# EAGLE design Sensor Board (EAGLE 6.4)

## Sheet 1 of 8: Microcontroller
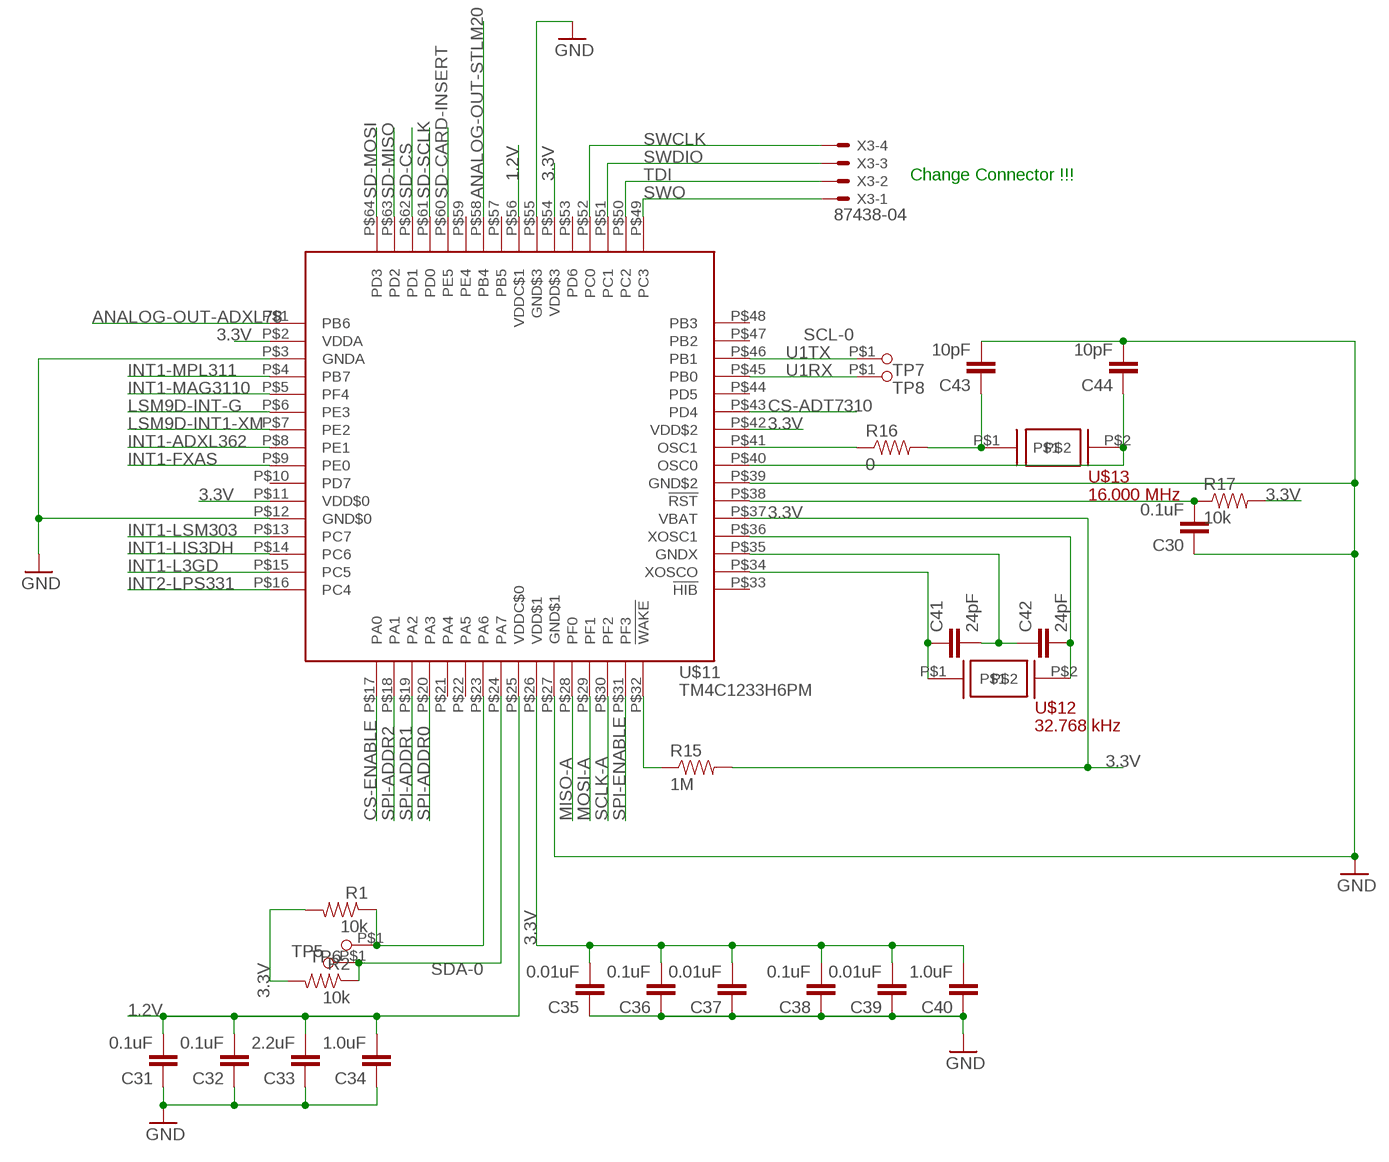
[diagram p0: schematic, sheet 1]

### Parts
C30  0.1uF  CAPACITOR  [0402-CAP]
C31  0.1uF  CAPACITOR  [0402-CAP]
C32  0.1uF  CAPACITOR  [0402-CAP]
C33  2.2uF  CAPACITOR  [0402-CAP]
C34  1.0uF  CAPACITOR  [0402-CAP]
C35  0.01uF  CAPACITOR  [0402-CAP]
C36  0.1uF  CAPACITOR  [0402-CAP]
C37  0.01uF  CAPACITOR  [0402-CAP]
C38  0.1uF  CAPACITOR  [0402-CAP]
C39  0.01uF  CAPACITOR  [0402-CAP]
C40  1.0uF  CAPACITOR  [0402-CAP]
C41  24pF  CAPACITOR  [0402-CAP]
C42  24pF  CAPACITOR  [0402-CAP]
C43  10pF  CAPACITOR  [0402-CAP]
C44  10pF  CAPACITOR  [0402-CAP]
R1  10k  RESISTOR  [0402]
R2  10k  RESISTOR  [0402]
R15  1M  RESISTOR  [0402]
R16  0  RESISTOR  [0402]
R17  10k  RESISTOR  [0402]
TP5  TESTPAD(ROUND)  [TESTPAD(ROUND)]
TP6  TESTPAD(ROUND)  [TESTPAD(ROUND)]
TP7  TESTPAD(ROUND)  [TESTPAD(ROUND)]
TP8  TESTPAD(ROUND)  [TESTPAD(ROUND)]
U$11  TM4C1233H6PM  [S-PQFP-G64]
U$12  32.768 kHz  AB26TRB  [CYLINDRICAL-(1.9DIAX6L)]
U$13  16.000 MHz  NX5032GA  [2-SMD]
X3  87438-04  [87438-04]

### Nets
1.2V: C31.2 C32.2 C33.2 C34.2 U$11.P$25(VDDC$0) U$11.P$56(VDDC$1) ; also sheet 8
3.3V: C35.2 C36.2 C37.2 C38.2 C39.2 C40.2 R1.2 R2.2 R15.2 R17.2 U$11.P$2(VDDA) U$11.P$11(VDD$0) U$11.P$26(VDD$1) U$11.P$37(VBAT) U$11.P$42(VDD$2) U$11.P$54(VDD$3) ; also sheet 2,3,4,5,6,7,8
ANALOG-OUT-ADXL78: U$11.P$1(PB6) ; also sheet 6
ANALOG-OUT-STLM20: U$11.P$58(PB4) ; also sheet 6
CS-ADT7310: U$11.P$43(PD4) ; also sheet 4
CS-ENABLE: U$11.P$17(PA0) ; also sheet 7
GND: C30.1 C31.1 C32.1 C33.1 C34.1 C35.1 C36.1 C37.1 C38.1 C39.1 C40.1 C43.2 C44.2 U$11.P$3(GNDA) U$11.P$12(GND$0) U$11.P$27(GND$1) U$11.P$39(GND$2) U$11.P$55(GND$3) ; also sheet 2,3,4,5,6,7,8
INT1-ADXL362: U$11.P$8(PE1) ; also sheet 4
INT1-FXAS: U$11.P$9(PE0) ; also sheet 5
INT1-L3GD: U$11.P$15(PC5) ; also sheet 3
INT1-LIS3DH: U$11.P$14(PC6) ; also sheet 3
INT1-LSM303: U$11.P$13(PC7) ; also sheet 2
INT1-MAG3110: U$11.P$5(PF4) ; also sheet 5
INT1-MPL311: U$11.P$4(PB7) ; also sheet 5
INT2-LPS331: U$11.P$16(PC4) ; also sheet 3
LSM9D-INT1-XM: U$11.P$7(PE2) ; also sheet 2
LSM9D-INT-G: U$11.P$6(PE3) ; also sheet 2
MISO-A: U$11.P$28(PF0) ; also sheet 7
MOSI-A: U$11.P$29(PF1) ; also sheet 7
N$10: C30.2 R17.1 U$11.P$38(!RST)
N$11: C42.2 U$11.P$36(XOSC1) U$12.P$2
N$12: C41.1 U$11.P$34(XOSCO) U$12.P$1
N$13: C41.2 C42.1 U$11.P$35(GNDX)
N$14: C43.1 R16.2 U$13.P$1
N$16: C44.1 U$11.P$40(OSC0) U$13.P$2
N$17: R16.1 U$11.P$41(OSC1)
N$18: R15.1 U$11.P$32(!WAKE)
SCL-0: R1.1 TP6.P$1 U$11.P$23(PA6) ; also sheet 5
SCLK-A: U$11.P$30(PF2) ; also sheet 7
SD-CARD-INSERT: U$11.P$60(PE5) ; also sheet 7
SD-CS: U$11.P$62(PD1) ; also sheet 7
SD-MISO: U$11.P$63(PD2) ; also sheet 7
SD-MOSI: U$11.P$64(PD3) ; also sheet 7
SD-SCLK: U$11.P$61(PD0) ; also sheet 7
SDA-0: R2.1 TP5.P$1 U$11.P$24(PA7) ; also sheet 5
SPI-ADDR0: U$11.P$20(PA3) ; also sheet 7
SPI-ADDR1: U$11.P$19(PA2) ; also sheet 7
SPI-ADDR2: U$11.P$18(PA1) ; also sheet 7
SPI-ENABLE: U$11.P$31(PF3) ; also sheet 7
SWCLK: U$11.P$52(PC0) X3.4
SWDIO: U$11.P$51(PC1) X3.3
SWO: U$11.P$49(PC3) X3.1
TDI: U$11.P$50(PC2) X3.2
U1RX: TP8.P$1 U$11.P$45(PB0)
U1TX: TP7.P$1 U$11.P$46(PB1)
Unconnected: U$11.P$10(PD7) U$11.P$21(PA4) U$11.P$22(PA5) U$11.P$33(!HIB) U$11.P$44(PD5) U$11.P$47(PB2) U$11.P$48(PB3) U$11.P$53(PD6) U$11.P$57(PB5) U$11.P$59(PE4)

### Notes on the sheet
- Change Connector !!!

## Sheet 2 of 8: STM - Sensors
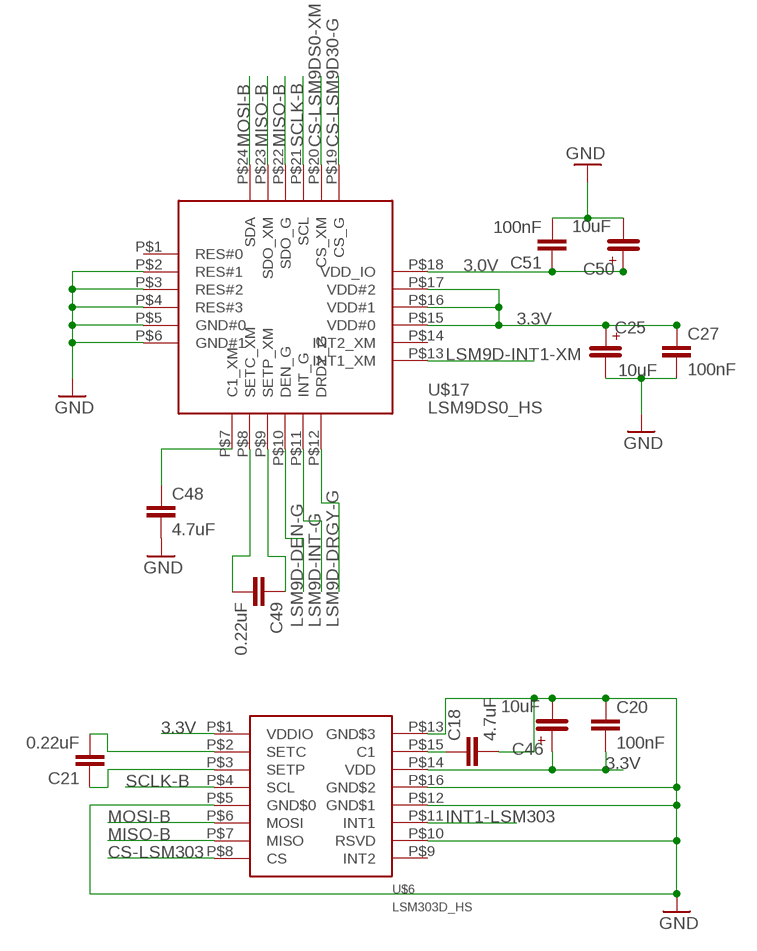
[diagram p1: schematic, sheet 2]

### Parts
C18  4.7uF  CAPACITOR  [0402-CAP]
C20  100nF  CAPACITOR  [0402-CAP]
C21  0.22uF  CAPACITOR  [0402-CAP]
C25  10uF  EEFCD0J100ER  [4.3X7.3SMD]
C27  100nF  CAPACITOR  [0402-CAP]
C46  10uF  EEFCD0J100ER  [4.3X7.3SMD]
C48  4.7uF  CAPACITOR  [0402-CAP]
C49  0.22uF  CAPACITOR  [0402-CAP]
C50  10uF  EEFCD0J100ER  [4.3X7.3SMD]
C51  100nF  CAPACITOR  [0402-CAP]
U$6  LSM303D_HS  [LGA-16(3X3)_HS]
U$17  LSM9DS0_HS  [LGA-24(4X4)_HS]

### Nets
3.0V: C50.P$1 C51.1 U$17.P$18(VDD_IO) ; also sheet 8
3.3V: C20.2 C25.P$1 C27.1 C46.P$1 U$6.P$1(VDDIO) U$6.P$14(VDD) U$17.P$15(VDD#0) U$17.P$16(VDD#1) U$17.P$17(VDD#2) ; also sheet 1,3,4,5,6,7,8
CS-LSM9D30-G: U$17.P$19(CS_G) ; also sheet 7
CS-LSM9DS0-XM: U$17.P$20(CS_XM) ; also sheet 7
CS-LSM303: U$6.P$8(CS) ; also sheet 7
GND: C18.2 C20.1 C25.P$2 C27.2 C46.P$2 C48.2 C50.P$2 C51.2 U$6.P$5(GND$0) U$6.P$10(RSVD) U$6.P$12(GND$1) U$6.P$13(GND$3) U$6.P$16(GND$2) U$17.P$2(RES#1) U$17.P$3(RES#2) U$17.P$4(RES#3) U$17.P$5(GND#0) U$17.P$6(GND#1) ; also sheet 1,3,4,5,6,7,8
INT1-LSM303: U$6.P$11(INT1) ; also sheet 1
LSM9D-DEN-G: U$17.P$10(DEN_G)
LSM9D-DRGY-G: U$17.P$12(DRDY_G)
LSM9D-INT1-XM: U$17.P$13(INT1_XM) ; also sheet 1
LSM9D-INT-G: U$17.P$11(INT_G) ; also sheet 1
MISO-B: U$6.P$7(MISO) U$17.P$22(SDO_G) U$17.P$23(SDO_XM) ; also sheet 3,4,5,7
MOSI-B: U$6.P$6(MOSI) U$17.P$24(SDA) ; also sheet 3,4,5,7
N$6: C18.1 U$6.P$15(C1)
N$7: C21.2 U$6.P$2(SETC)
N$8: C48.1 U$17.P$7(C1_XM)
N$15: C21.1 U$6.P$3(SETP)
N$21: C49.2 U$17.P$8(SETC_XM)
N$22: C49.1 U$17.P$9(SETP_XM)
SCLK-B: U$6.P$4(SCL) U$17.P$21(SCL) ; also sheet 3,4,5,7
Unconnected: U$6.P$9(INT2) U$17.P$1(RES#0) U$17.P$14(INT2_XM)

## Sheet 3 of 8: STM - Sensors 2
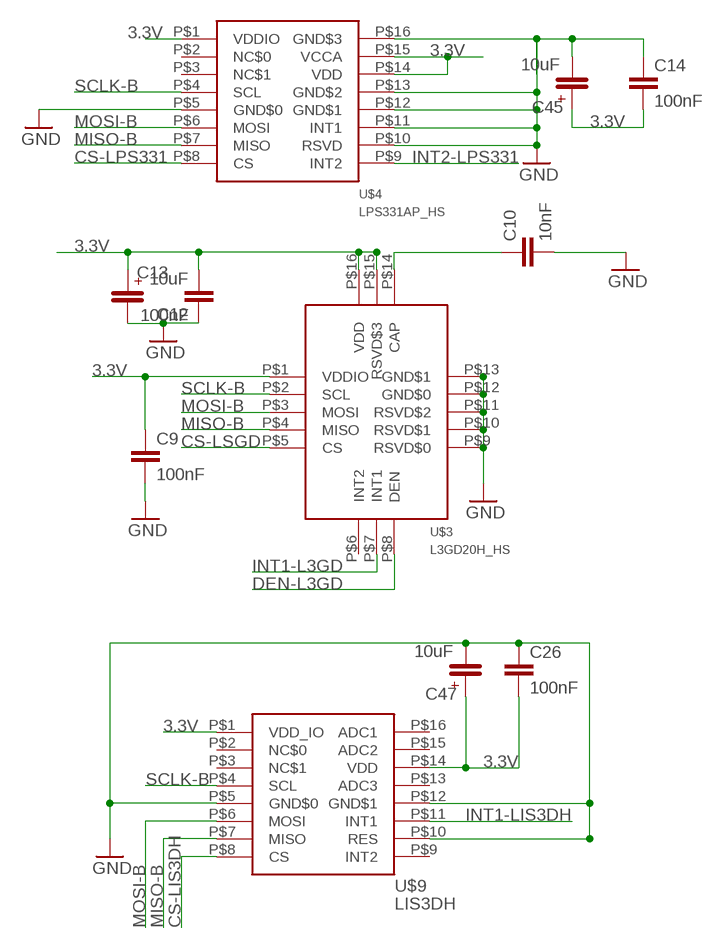
[diagram p2: schematic, sheet 3]

### Parts
C9  100nF  CAPACITOR  [0402-CAP]
C10  10nF  CAPACITOR  [0402-CAP]
C12  10uF  CAPACITOR  [0402-CAP]
C13  100nF  EEFCD0J100ER  [4.3X7.3SMD]
C14  100nF  CAPACITOR  [0402-CAP]
C26  100nF  CAPACITOR  [0402-CAP]
C45  10uF  EEFCD0J100ER  [4.3X7.3SMD]
C47  10uF  EEFCD0J100ER  [4.3X7.3SMD]
U$3  L3GD20H_HS  [LGA-16(3X3)_HS]
U$4  LPS331AP_HS  [LGA-16(3X3)_HS]
U$9  LIS3DH  LIS3DH_HS  [LGA-16(3X3)_HS]

### Nets
3.3V: C9.1 C12.2 C13.P$1 C14.2 C26.2 C45.P$1 C47.P$1 U$3.P$1(VDDIO) U$3.P$15(RSVD$3) U$3.P$16(VDD) U$4.P$1(VDDIO) U$4.P$14(VDD) U$4.P$15(VCCA) U$9.P$1(VDD_IO) U$9.P$14(VDD) ; also sheet 1,2,4,5,6,7,8
CS-LIS3DH: U$9.P$8(CS) ; also sheet 7
CS-LPS331: U$4.P$8(CS) ; also sheet 7
CS-LSGD: U$3.P$5(CS) ; also sheet 7
DEN-L3GD: U$3.P$8(DEN)
GND: C9.2 C10.2 C12.1 C13.P$2 C14.1 C26.1 C45.P$2 C47.P$2 U$3.P$9(RSVD$0) U$3.P$10(RSVD$1) U$3.P$11(RSVD$2) U$3.P$12(GND$0) U$3.P$13(GND$1) U$4.P$5(GND$0) U$4.P$10(RSVD) U$4.P$11(INT1) U$4.P$12(GND$1) U$4.P$13(GND$2) U$4.P$16(GND$3) U$9.P$5(GND$0) U$9.P$10(RES) U$9.P$12(GND$1) ; also sheet 1,2,4,5,6,7,8
INT1-L3GD: U$3.P$7(INT1) ; also sheet 1
INT1-LIS3DH: U$9.P$11(INT1) ; also sheet 1
INT2-LPS331: U$4.P$9(INT2) ; also sheet 1
MISO-B: U$3.P$4(MISO) U$4.P$7(MISO) U$9.P$7(MISO) ; also sheet 2,4,5,7
MOSI-B: U$3.P$3(MOSI) U$4.P$6(MOSI) U$9.P$6(MOSI) ; also sheet 2,4,5,7
N$4: C10.1 U$3.P$14(CAP)
SCLK-B: U$3.P$2(SCL) U$4.P$4(SCL) U$9.P$4(SCL) ; also sheet 2,4,5,7
Unconnected: U$3.P$6(INT2) U$4.P$2(NC$0) U$4.P$3(NC$1) U$9.P$2(NC$0) U$9.P$3(NC$1) U$9.P$9(INT2) U$9.P$13(ADC3) U$9.P$15(ADC2) U$9.P$16(ADC1)

## Sheet 4 of 8: ADXL - Sensors
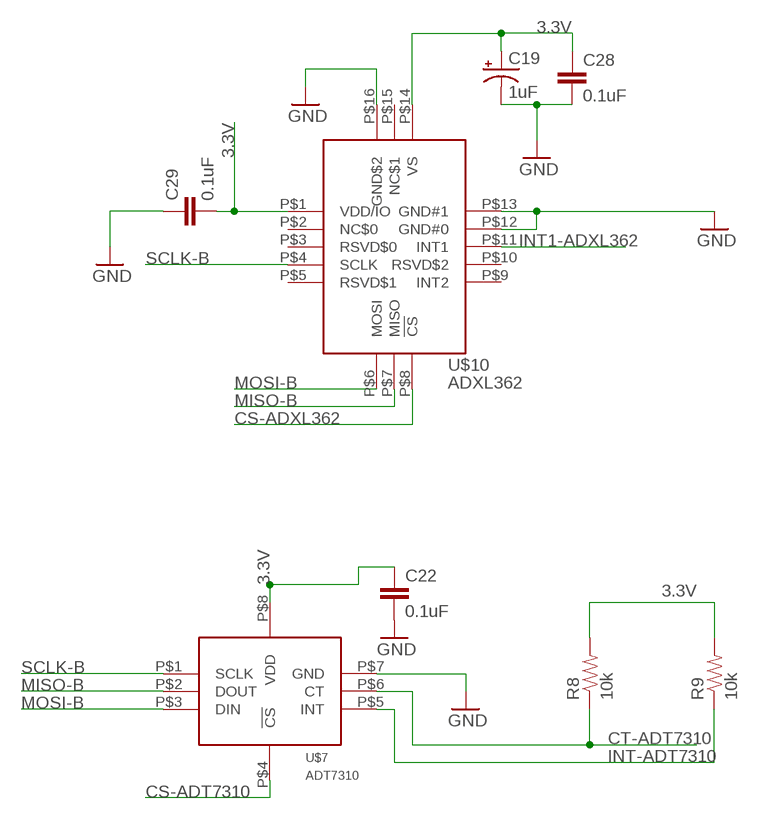
[diagram p3: schematic, sheet 4]

### Parts
C19  1uF  CAP_POL6032  [EIA6032]
C22  0.1uF  CAPACITOR  [0402-CAP]
C28  0.1uF  CAPACITOR  [0402-CAP]
C29  0.1uF  CAPACITOR  [0402-CAP]
R8  10k  RESISTOR  [0402]
R9  10k  RESISTOR  [0402]
U$7  ADT7310  [SOIC-8(5X6.2)]
U$10  ADXL362  ADXL362_HS  [LGA-16(3X3.25)_HS]

### Nets
3.3V: C19.P$1(+) C22.1 C28.1 C29.2 R8.2 R9.2 U$7.P$8(VDD) U$10.P$1(VDD/IO) U$10.P$14(VS) ; also sheet 1,2,3,5,6,7,8
CS-ADT7310: U$7.P$4(!CS) ; also sheet 1
CS-ADXL362: U$10.P$8(!CS) ; also sheet 7
CT-ADT7310: R8.1 U$7.P$6(CT)
GND: C19.P$2(-) C22.2 C28.2 C29.1 U$7.P$7(GND) U$10.P$12(GND#0) U$10.P$13(GND#1) U$10.P$16(GND$2) ; also sheet 1,2,3,5,6,7,8
INT1-ADXL362: U$10.P$11(INT1) ; also sheet 1
INT-ADT7310: R9.1 U$7.P$5(INT)
MISO-B: U$7.P$2(DOUT) U$10.P$7(MISO) ; also sheet 2,3,5,7
MOSI-B: U$7.P$3(DIN) U$10.P$6(MOSI) ; also sheet 2,3,5,7
SCLK-B: U$7.P$1(SCLK) U$10.P$4(SCLK) ; also sheet 2,3,5,7
Unconnected: U$10.P$2(NC$0) U$10.P$3(RSVD$0) U$10.P$5(RSVD$1) U$10.P$9(INT2) U$10.P$10(RSVD$2) U$10.P$15(NC$1)

## Sheet 5 of 8: Freescale - Sensors
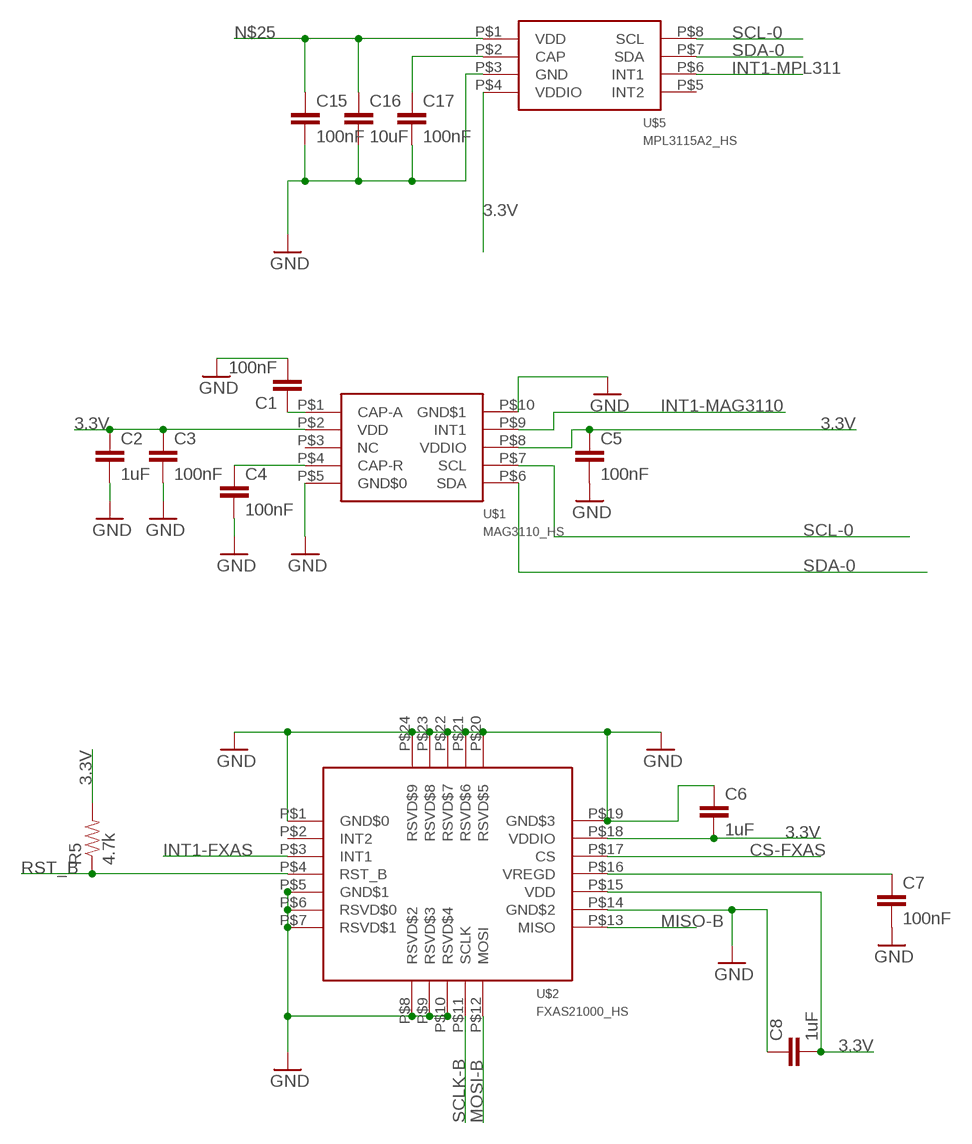
[diagram p4: schematic, sheet 5]

### Parts
C1  100nF  CAPACITOR  [0402-CAP]
C2  1uF  CAPACITOR  [0402-CAP]
C3  100nF  CAPACITOR  [0402-CAP]
C4  100nF  CAPACITOR  [0402-CAP]
C5  100nF  CAPACITOR  [0402-CAP]
C6  1uF  CAPACITOR  [0402-CAP]
C7  100nF  CAPACITOR  [0402-CAP]
C8  1uF  CAPACITOR  [0402-CAP]
C15  100nF  CAPACITOR  [0402-CAP]
C16  10uF  CAPACITOR  [0402-CAP]
C17  100nF  CAPACITOR  [0402-CAP]
R5  4.7k  RESISTOR  [0402]
U$1  MAG3110_HS  [DFN-10(2X2)_HS]
U$2  FXAS21000_HS  [QFN-24(4X4)_HS]
U$5  MPL3115A2_HS  [LGA-8(5X3)_HS]

### Nets
3.3V: C2.1 C3.1 C5.1 C6.2 C8.2 R5.2 U$1.P$2(VDD) U$1.P$8(VDDIO) U$2.P$15(VDD) U$2.P$18(VDDIO) U$5.P$4(VDDIO) ; also sheet 1,2,3,4,6,7,8
CS-FXAS: U$2.P$17(CS) ; also sheet 7
GND: C1.2 C2.2 C3.2 C4.2 C5.2 C6.1 C7.2 C8.1 C15.2 C16.2 C17.2 U$1.P$5(GND$0) U$1.P$10(GND$1) U$2.P$1(GND$0) U$2.P$5(GND$1) U$2.P$6(RSVD$0) U$2.P$7(RSVD$1) U$2.P$8(RSVD$2) U$2.P$9(RSVD$3) U$2.P$10(RSVD$4) U$2.P$14(GND$2) U$2.P$19(GND$3) U$2.P$20(RSVD$5) U$2.P$21(RSVD$6) U$2.P$22(RSVD$7) U$2.P$23(RSVD$8) U$2.P$24(RSVD$9) U$5.P$3(GND) ; also sheet 1,2,3,4,6,7,8
INT1-FXAS: U$2.P$3(INT1) ; also sheet 1
INT1-MAG3110: U$1.P$9(INT1) ; also sheet 1
INT1-MPL311: U$5.P$6(INT1) ; also sheet 1
MISO-B: U$2.P$13(MISO) ; also sheet 2,3,4,7
MOSI-B: U$2.P$12(MOSI) ; also sheet 2,3,4,7
N$1: C1.1 U$1.P$1(CAP-A)
N$2: C7.1 U$2.P$16(VREGD)
N$3: C4.1 U$1.P$4(CAP-R)
N$5: C17.1 U$5.P$2(CAP)
N$25: C15.1 C16.1 U$5.P$1(VDD)
RST_B: R5.1 U$2.P$4(RST_B)
SCL-0: U$1.P$7(SCL) U$5.P$8(SCL) ; also sheet 1
SCLK-B: U$2.P$11(SCLK) ; also sheet 2,3,4,7
SDA-0: U$1.P$6(SDA) U$5.P$7(SDA) ; also sheet 1
Unconnected: U$1.P$3(NC) U$2.P$2(INT2) U$5.P$5(INT2)

## Sheet 6 of 8: Analog - Sensors
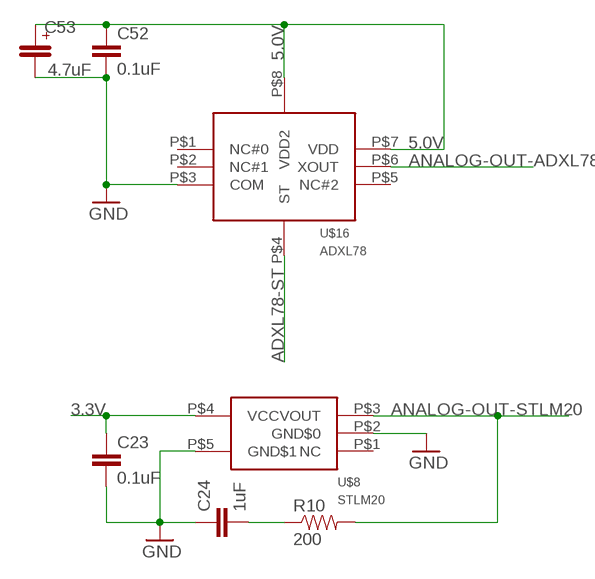
[diagram p5: schematic, sheet 6]

### Parts
C23  0.1uF  CAPACITOR  [0402-CAP]
C24  1uF  CAPACITOR  [0402-CAP]
C52  0.1uF  CAPACITOR  [0402-CAP]
C53  4.7uF  EEFCD0J100ER  [4.3X7.3SMD]
R10  200  RESISTOR  [0402]
U$8  STLM20  [SOT323-5L]
U$16  ADXL78  [LCC-8(5X5)_HS]

### Nets
3.3V: C23.1 U$8.P$4(VCC) ; also sheet 1,2,3,4,5,7,8
5.0V: C52.1 C53.P$1 U$16.P$7(VDD) U$16.P$8(VDD2) ; also sheet 8
ADXL78-ST: U$16.P$4(ST)
ANALOG-OUT-ADXL78: U$16.P$6(XOUT) ; also sheet 1
ANALOG-OUT-STLM20: R10.2 U$8.P$3(VOUT) ; also sheet 1
GND: C23.2 C24.1 C52.2 C53.P$2 U$8.P$2(GND$0) U$8.P$5(GND$1) U$16.P$3(COM) ; also sheet 1,2,3,4,5,7,8
N$9: C24.2 R10.1
Unconnected: U$8.P$1(NC) U$16.P$1(NC#0) U$16.P$2(NC#1) U$16.P$5(NC#2)

## Sheet 7 of 8: SPI/SD Comunication
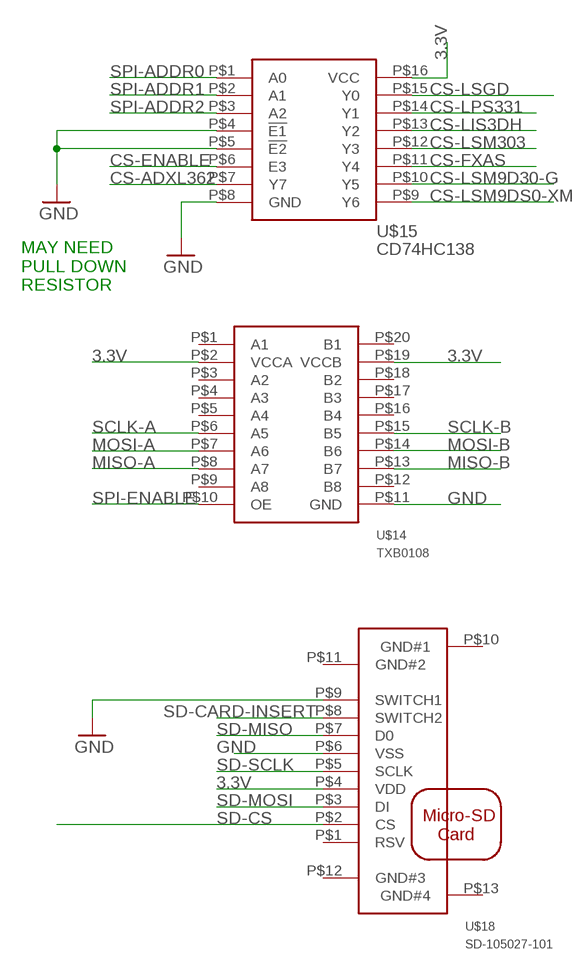
[diagram p6: schematic, sheet 7]

### Parts
U$14  TXB0108  [TSSOP-(PW)-20]
U$15  CD74HC138  [SOIC-16]
U$18  SD-105027-101  [SD-105027-101]

### Nets
3.3V: U$14.P$2(VCCA) U$14.P$19(VCCB) U$15.P$16(VCC) U$18.P$4(VDD) ; also sheet 1,2,3,4,5,6,8
CS-ADXL362: U$15.P$7(Y7) ; also sheet 4
CS-ENABLE: U$15.P$6(E3) ; also sheet 1
CS-FXAS: U$15.P$11(Y4) ; also sheet 5
CS-LIS3DH: U$15.P$13(Y2) ; also sheet 3
CS-LPS331: U$15.P$14(Y1) ; also sheet 3
CS-LSGD: U$15.P$15(Y0) ; also sheet 3
CS-LSM9D30-G: U$15.P$10(Y5) ; also sheet 2
CS-LSM9DS0-XM: U$15.P$9(Y6) ; also sheet 2
CS-LSM303: U$15.P$12(Y3) ; also sheet 2
GND: U$14.P$11(GND) U$15.P$4(!E1) U$15.P$5(!E2) U$15.P$8(GND) U$18.P$6(VSS) U$18.P$9(SWITCH1) ; also sheet 1,2,3,4,5,6,8
MISO-A: U$14.P$8(A7) ; also sheet 1
MISO-B: U$14.P$13(B7) ; also sheet 2,3,4,5
MOSI-A: U$14.P$7(A6) ; also sheet 1
MOSI-B: U$14.P$14(B6) ; also sheet 2,3,4,5
SCLK-A: U$14.P$6(A5) ; also sheet 1
SCLK-B: U$14.P$15(B5) ; also sheet 2,3,4,5
SD-CARD-INSERT: U$18.P$8(SWITCH2) ; also sheet 1
SD-CS: U$18.P$2(CS) ; also sheet 1
SD-MISO: U$18.P$7(D0) ; also sheet 1
SD-MOSI: U$18.P$3(DI) ; also sheet 1
SD-SCLK: U$18.P$5(SCLK) ; also sheet 1
SPI-ADDR0: U$15.P$1(A0) ; also sheet 1
SPI-ADDR1: U$15.P$2(A1) ; also sheet 1
SPI-ADDR2: U$15.P$3(A2) ; also sheet 1
SPI-ENABLE: U$14.P$10(OE) ; also sheet 1
Unconnected: U$14.P$1(A1) U$14.P$3(A2) U$14.P$4(A3) U$14.P$5(A4) U$14.P$9(A8) U$14.P$12(B8) U$14.P$16(B4) U$14.P$17(B3) U$14.P$18(B2) U$14.P$20(B1) U$18.P$1(RSV) U$18.P$10(GND#1) U$18.P$11(GND#2) U$18.P$12(GND#3) U$18.P$13(GND#4)

### Notes on the sheet
- MAY NEED
  PULL DOWN
  RESISTOR

## Sheet 8 of 8: Power
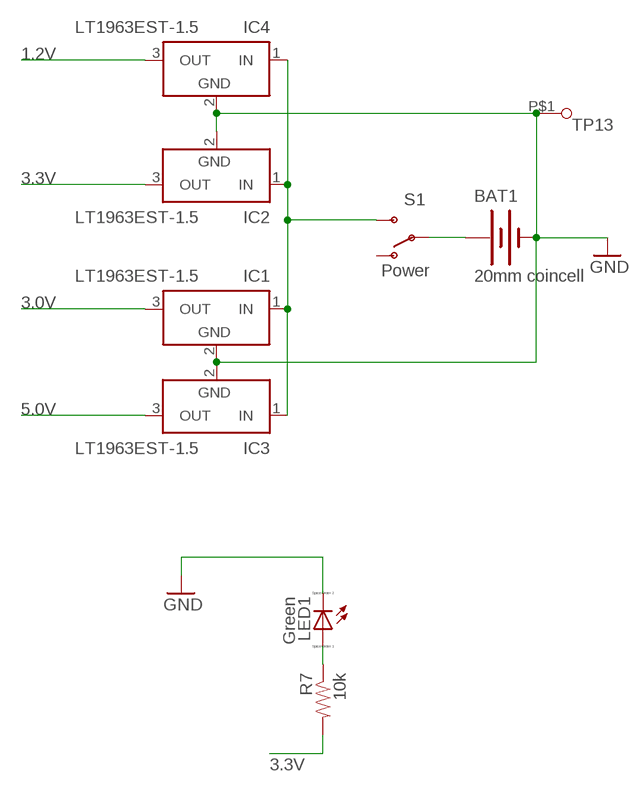
[diagram p7: schematic, sheet 8]

### Parts
BAT1  20mm coincell  BATTERY20MM_4LEGS  [BATTCON_20MM_4LEGS]
IC1  LT1963EST-1.5  [SOT223]
IC2  LT1963EST-1.5  [SOT223]
IC3  LT1963EST-1.5  [SOT223]
IC4  LT1963EST-1.5  [SOT223]
LED1  Green  LED_ESML0603  [LED_SML0603]
R7  10k  RESISTOR  [0402]
S1  Power  SWITCH-SPDT-SMD-A  [SWITCH-SPST-SMD-A]
TP13  TESTPAD(ROUND)  [TESTPAD(ROUND)]

### Nets
1.2V: IC4.3(OUT) ; also sheet 1
3.0V: IC1.3(OUT) ; also sheet 2
3.3V: IC2.3(OUT) R7.2 ; also sheet 1,2,3,4,5,6,7
5.0V: IC3.3(OUT) ; also sheet 6
GND: BAT1.2(-) IC1.2(GND) IC2.2(GND) IC3.2(GND) IC4.2(GND) LED1.C TP13.P$1 ; also sheet 1,2,3,4,5,6,7
N$19: BAT1.1(+) S1.2(P)
N$23: IC1.1(IN) IC2.1(IN) IC3.1(IN) IC4.1(IN) S1.3(S)
N$27: LED1.A R7.1
Unconnected: S1.1(O)

## Power pins joined to a net without a drawn wire
GND: IC1.4(GND) IC2.4(GND) IC3.4(GND) IC4.4(GND)

## Library data of the parts
BAT1 = SparkFun-Electromechanical:BATTERY: Battery Holders Various common sizes : AA, AAA, 20mm coin cell and 12mm coin cell. 20MM_4LEGS, BATT-10373; PROD_ID: BATT-10373
C1-C10 C12 C14-C18 C20-C24 C26-C44 C48 C49 C51 C52 = Kas-Passives:CAPACITOR: Ceramic SMT Capacitor
C13 C25 C45-C47 C50 C53 = Kas-Passives:EEFCD0J100ER: ALU Capacitor
C19 = SparkFun-Passives:CAP_POL: Capacitor Polarized These are standard SMD and PTH capacitors. Normally 10uF, 47uF, and 100uF in electrolytic and tantalum varieties. Always verify the external diameter of the through hole cap, it varies with capacity, voltage, and manufacturer. The EIA devices should be standard.
IC1-IC4 = linear-technology:LT1963EST: 1.5A, Low Noise, Fast Transient Response LDO Regulator Source: http://www.linear.com/pc/downloadDocument.do?navId=H0,C3,P2222,D3148; MPN: LT1963EST-1.5; OC_FARNELL: 1663528; OC_NEWARK: 57M7534
LED1 = eagle-ltspice:LED_E: LED Source: http://www.osram.convergy.de Source: www.luxeon.com Source: www.kingbright.com; SPICEMODEL: NONE; SPICEPREFIX: D; SPICETYPE: diode
R1 R2 R5 R7-R10 R15-R17 = Kas-Passives:RESISTOR: 0402 Resistor
S1 = SparkFun-Electromechanical:SWITCH-SPDT: SPDT Switch Simple slide switch, Spark Fun Electronics SKU : COM-00102 DPDT SMT slide switch, AYZ0202, SWCH-08179
TP5-TP8 TP13 = Kas-Passives:TESTPAD(ROUND)
U$1 = Kas-Sensors:MAG3110: MAG3110 in a 2x2 DFN-10 package
U$2 = Kas-Sensors:FXAS21000: FXAS21000 in a 4x4 QFN-24 package
U$3 = Kas-Sensors:L3GD20H: L3GD20H in a 3x3 LGA-16 package
U$4 = Kas-Sensors:LPS331AP: LPS331AP in a 3x3 HCLGA-16 package
U$5 = Kas-Sensors:MPL3115A2: MPL3115A2 in a 3x5 LGA-8 package
U$6 = Kas-Sensors:LSM303D: LSM303D in a 3x3 LGA-16 package
U$7 = Kas-Sensors:ADT7310: ADT7310 in a 5x6.2 SOIC-8 package
U$8 = Kas-Sensors:STLM20: STLM20 in a 1.35x2.2 SOT323-5L package
U$9 = Kas-Sensors:LIS3DH: LIS3DH in a 3x3 LGA-16 package
U$10 = Kas-Sensors:ADXL362: ADXL362 in a 3x3.25 LGA-16 Package
U$11 = Kas-Microcontroller:TM4C1233H6PM: TM4C1233H6PM in a 10.2x10.2 S-PQFP-G64 package
U$12 = Kas-Crystal:AB26TRB: AB26TRB in a cylindrical (1.90mm x 6.00mm) package AB26TRB-32.768KHZ
U$13 = Kas-Crystal:NX5032GA: NX5032GA in a 2-SMD (5mmx3.2mm) package
U$14 = Kas-Buffers & Level Shifters:TXB0108
U$15 = Kas-Buffers & Level Shifters:CD74HC138
U$16 = Kas-Sensors:ADXL78: ADXL78 in a 5x5 LCC-8 package
U$17 = Kas-Sensors:LSM9DS0
U$18 = Kas-Connectors:SD-105027-101
X3 = con-molex:87438-04: Wire-to-Board 1.50mm (.059") Pitch Header - Right Angle, SMT, Shrouded Source: http://www.molex.com/product/micro/87438.html; OC_FARNELL: unknown; OC_NEWARK: unknown

## Board
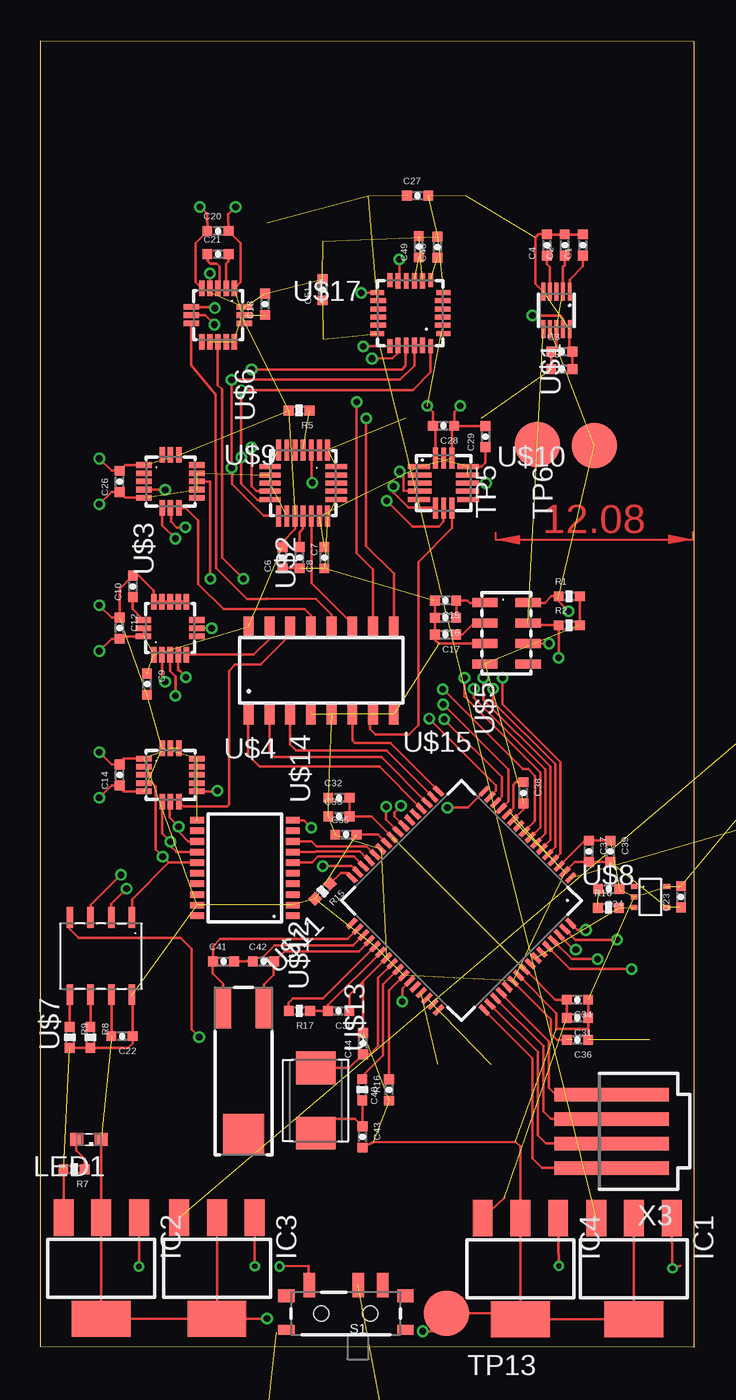
[diagram p8: board, top side]
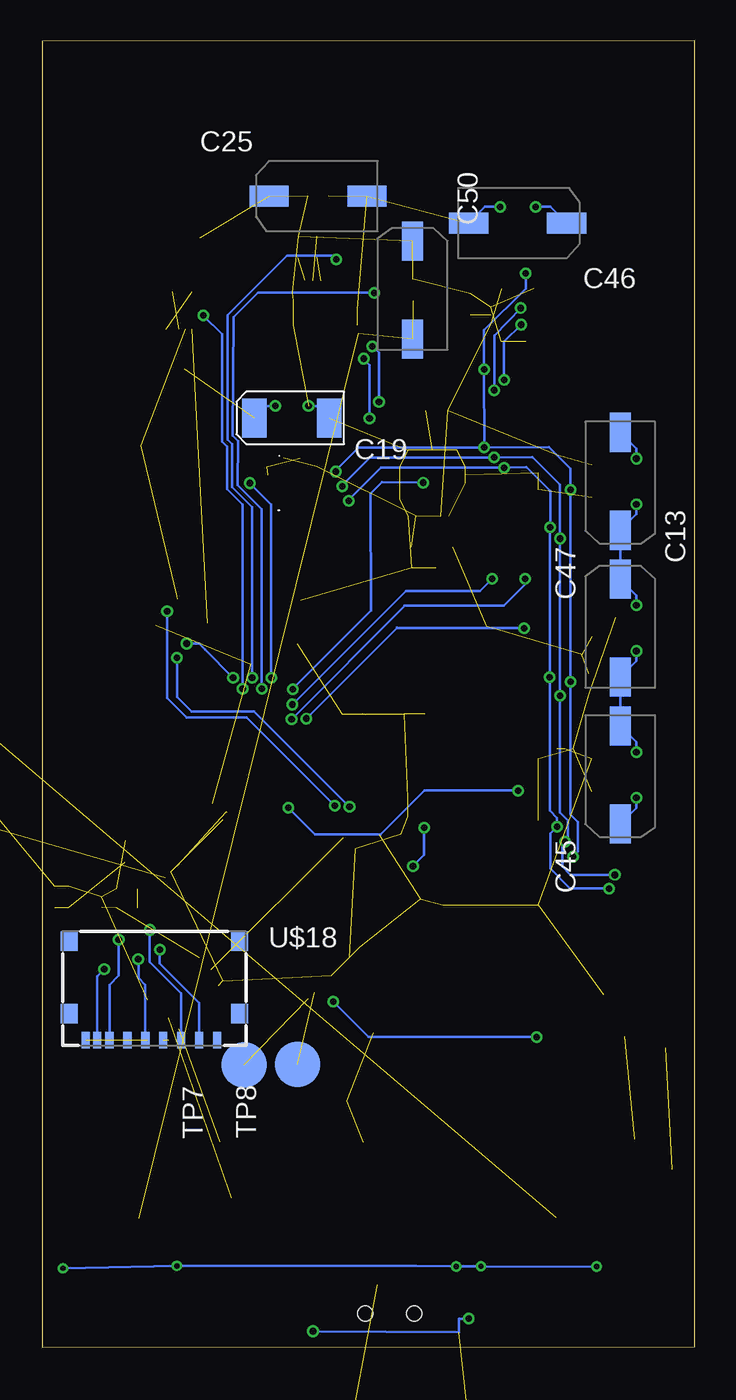
[diagram p9: board, bottom side, seen from below]

Size 40 x 80.03 mm. Coordinates in mm from the lower left corner, seen from the top.
Outline: 40,0 0,0.03 0,80.03 40,80 40,0
Copper layers (1*2*15*16): Top 0.035mm / dielectric 0.2mm / Route2 0.0175mm / dielectric 1.1mm / Route15 0.0175mm / dielectric 0.2mm / Bottom 0.035mm
Design rules "SeeedStudio_DRU_no_angle_20130527": minimum track width 6mil, minimum drill 12mil, track to track 6mil, track to pad 6mil, pad to pad 6mil, via to via 6mil, smd to smd 0mil, copper to edge 10mil, drill to drill 10mil, minimum pad ring 6mil, minimum via ring 6mil, stop-mask expansion 2mil, vias tented up to drill 25mil, thermal gap 10mil

### Footprints (pad centres in the part's own frame; a part is rotated, then mirrored left to right if it is on the bottom)
BATTCON_20MM_4LEGS = smd 1.778 x 2.54: 1 -11,1.55; 3 11,1.55; P$1 -11,-1.55; P$2 11,-1.55 | smd 13 x 8: 2 0,0
0402-CAP = smd 0.6 x 0.6: 1 -0.65,0; 2 0.65,0
4.3X7.3SMD = smd 2.4 x 1.3: P$1 -3,0; P$2 3,0
EIA6032 = smd 1.5 x 2.4: P$1 -2.3,0; P$2 2.3,0
SOT223 = smd 1.219 x 2.235: 1 -2.311,-3.099; 2 0,-3.099; 3 2.311,-3.099 | smd 3.6 x 2.2: 4 0,3.099
LED_SML0603 = smd 0.8 x 0.8: A 0.75,0; C -0.75,0
0402 = smd 0.6 x 0.6: 1 -0.65,0; 2 0.65,0
SWITCH-SPST-SMD-A = smd 0.7 x 1.5: 1 -2.25,-1.75; 2 -0.75,-1.75; 3 2.25,-1.75 | smd 1 x 0.6: GND1 -3.65,1; GND3 3.65,1 | smd 1 x 0.8: GND2 -3.65,-1.1; GND4 3.65,-1.1 | hole 0.9: -1.5,0; 1.5,0
TESTPAD(ROUND) = smd 2.794 x 2.794: P$1 0,0
DFN-10(2X2)_HS = smd 1.1 x 0.225: P$1 -1.15,0.8; P$2 -1.15,0.4; P$3 -1.15,0; P$4 -1.15,-0.4; P$5 -1.15,-0.8; P$6 1.15,-0.8; P$7 1.15,-0.4; P$8 1.15,0; P$9 1.15,0.4; P$10 1.15,0.8
QFN-24(4X4)_HS = smd 1.3 x 0.3: P$1 -2.025,1.5; P$2 -2.025,1; P$3 -2.025,0.5; P$4 -2.025,0; P$5 -2.025,-0.5; P$6 -2.025,-1; P$7 -2.025,-1.5; P$13 2.025,-1.5; P$14 2.025,-1; P$15 2.025,-0.5; P$16 2.025,0; P$17 2.025,0.5; P$18 2.025,1; P$19 2.025,1.5 | smd 0.3 x 1.3: P$8 -1,-2.025; P$9 -0.5,-2.025; P$10 0,-2.025; P$11 0.5,-2.025; P$12 1,-2.025; P$20 1,2.025; P$21 0.5,2.025; P$22 0,2.025; P$23 -0.5,2.025; P$24 -1,2.025
LGA-16(3X3)_HS = smd 0.95 x 0.34: P$1 -1.625,1; P$2 -1.625,0.5; P$3 -1.625,0; P$4 -1.625,-0.5; P$5 -1.625,-1; P$9 1.625,-1; P$10 1.625,-0.5; P$11 1.625,0; P$12 1.625,0.5; P$13 1.625,1 | smd 0.34 x 0.95: P$6 -0.5,-1.625; P$7 0,-1.625; P$8 0.5,-1.625; P$14 0.5,1.625; P$15 0,1.625; P$16 -0.5,1.625
LGA-8(5X3)_HS = smd 0.55 x 1.55: P$1 -1.875,-1.325; P$2 -0.625,-1.325; P$3 0.625,-1.325; P$4 1.875,-1.325; P$5 1.875,1.325; P$6 0.625,1.325; P$7 -0.625,1.325; P$8 -1.875,1.325
SOIC-8(5X6.2) = smd 1.27 x 0.41: P$1 -2.365,1.905; P$2 -2.365,0.635; P$3 -2.365,-0.635; P$4 -2.365,-1.905; P$5 2.365,-1.905; P$6 2.365,-0.635; P$7 2.365,0.635; P$8 2.365,1.905
SOT323-5L = smd 0.4 x 0.3: P$1 1,-0.65; P$2 1,0; P$3 1,0.65; P$4 -1,0.65; P$5 -1,-0.65
LGA-16(3X3.25)_HS = smd 1.32 x 0.3: P$1 -1.513,1; P$5 -1.513,-1; P$9 1.513,-1; P$13 1.513,1 | smd 1.425 x 0.3: P$2 -1.462,0.5; P$3 -1.462,0; P$4 -1.462,-0.5; P$10 1.462,-0.5; P$11 1.462,0; P$12 1.462,0.5 | smd 0.3 x 1.3: P$6 -0.5,-1.525; P$7 0,-1.525; P$8 0.5,-1.525; P$14 0.5,1.525; P$15 0,1.525; P$16 -0.5,1.525
S-PQFP-G64 = smd 0.75 x 0.27: P$1 -5.725,3.75; P$2 -5.725,3.25; P$3 -5.725,2.75; P$4 -5.725,2.25; P$5 -5.725,1.75; P$6 -5.725,1.25; P$7 -5.725,0.75; P$8 -5.725,0.25; P$9 -5.725,-0.25; P$10 -5.725,-0.75; P$11 -5.725,-1.25; P$12 -5.725,-1.75; P$13 -5.725,-2.25; P$14 -5.725,-2.75; P$15 -5.725,-3.25; P$16 -5.725,-3.75; P$33 5.725,-3.75; P$34 5.725,-3.25; P$35 5.725,-2.75; P$36 5.725,-2.25; P$37 5.725,-1.75; P$38 5.725,-1.25; P$39 5.725,-0.75; P$40 5.725,-0.25; P$41 5.725,0.25; P$42 5.725,0.75; P$43 5.725,1.25; P$44 5.725,1.75; P$45 5.725,2.25; P$46 5.725,2.75; P$47 5.725,3.25; P$48 5.725,3.75 | smd 0.27 x 0.75: P$17 -3.75,-5.725; P$18 -3.25,-5.725; P$19 -2.75,-5.725; P$20 -2.25,-5.725; P$21 -1.75,-5.725; P$22 -1.25,-5.725; P$23 -0.75,-5.725; P$24 -0.25,-5.725; P$25 0.25,-5.725; P$26 0.75,-5.725; P$27 1.25,-5.725; P$28 1.75,-5.725; P$29 2.25,-5.725; P$30 2.75,-5.725; P$31 3.25,-5.725; P$32 3.75,-5.725; P$49 3.75,5.725; P$50 3.25,5.725; P$51 2.75,5.725; P$52 2.25,5.725; P$53 1.75,5.725; P$54 1.25,5.725; P$55 0.75,5.725; P$56 0.25,5.725; P$57 -0.25,5.725; P$58 -0.75,5.725; P$59 -1.25,5.725; P$60 -1.75,5.725; P$61 -2.25,5.725; P$62 -2.75,5.725; P$63 -3.25,5.725; P$64 -3.75,5.725
CYLINDRICAL-(1.9DIAX6L) = smd 2.5 x 1: P$1 3.875,1.25; P$2 3.875,-1.25 | smd 2.5 x 2.5: P$3 -3.875,0
2-SMD = smd 2 x 2.4: P$1 -2,0; P$2 2,0
TSSOP-(PW)-20 = smd 0.4 x 0.85: P$1 -2.925,-2.925; P$2 -2.275,-2.925; P$3 -1.625,-2.925; P$4 -0.975,-2.925; P$5 -0.325,-2.925; P$6 0.325,-2.925; P$7 0.975,-2.925; P$8 1.625,-2.925; P$9 2.275,-2.925; P$10 2.925,-2.925; P$11 2.925,2.925; P$12 2.275,2.925; P$13 1.625,2.925; P$14 0.975,2.925; P$15 0.325,2.925; P$16 -0.325,2.925; P$17 -0.975,2.925; P$18 -1.625,2.925; P$19 -2.275,2.925; P$20 -2.925,2.925
SOIC-16 = smd 0.6 x 1.27: P$1 -4.445,-2.675; P$2 -3.175,-2.675; P$3 -1.905,-2.675; P$4 -0.635,-2.675; P$5 0.635,-2.675; P$6 1.905,-2.675; P$7 3.175,-2.675; P$8 4.445,-2.675; P$9 4.445,2.675; P$10 3.175,2.675; P$11 1.905,2.675; P$12 0.635,2.675; P$13 -0.635,2.675; P$14 -1.905,2.675; P$15 -3.175,2.675; P$16 -4.445,2.675
LCC-8(5X5)_HS = smd 1.87 x 0.735: P$1 -2.117,1.27; P$2 -2.117,0; P$3 -2.117,-1.27; P$5 2.117,-1.27; P$6 2.117,0; P$7 2.117,1.27 | smd 0.735 x 1.87: P$4 0,-2.117; P$8 0,2.117
LGA-24(4X4)_HS = smd 0.85 x 0.3: P$1 -2.025,1.25; P$6 -2.025,-1.25; P$13 2.025,-1.25; P$18 2.025,1.25 | smd 0.95 x 0.3: P$2 -1.975,0.75; P$3 -1.975,0.25; P$4 -1.975,-0.25; P$5 -1.975,-0.75; P$14 1.975,-0.75; P$15 1.975,-0.25; P$16 1.975,0.25; P$17 1.975,0.75 | smd 0.3 x 0.85: P$7 -1.25,-2.025; P$12 1.25,-2.025; P$19 1.25,2.025; P$24 -1.25,2.025 | smd 0.3 x 0.95: P$8 -0.75,-1.975; P$9 -0.25,-1.975; P$10 0.25,-1.975; P$11 0.75,-1.975; P$20 0.75,1.975; P$21 0.25,1.975; P$22 -0.25,1.975; P$23 -0.75,1.975
SD-105027-101 = smd 0.5 x 1: P$1 3.85,-6.66; P$2 2.75,-6.66; P$3 1.65,-6.66; P$4 0.55,-6.66; P$5 -0.55,-6.66; P$6 -1.65,-6.66; P$7 -2.75,-6.66; P$8 -3.51,-6.66; P$9 -4.21,-6.66 | smd 1.05 x 1.2: P$10 -5.225,-0.6; P$11 -5.225,-5.05; P$12 5.225,-5.05; P$13 5.225,-0.6
87438-04 = smd 7 x 0.85: 1 0,2.25; 2 0,0.75; 3 0,-0.75; 4 0,-2.25

### Placement (x,y rotation side)
BAT1  12.55,-16.43 180 top  (outside the outline)
C1  33.22,67.52 90 top
C2  32.11,67.51 90 top
C3  31.93,60.99 0 top
C4  31.01,67.51 90 top
C5  31.93,59.91 0 top
C6  14.81,48.36 90 top
C7  15.85,48.36 270 top
C8  17.37,48.36 90 top
C9  6.5,40.61 270 top
C10  5.64,46.61 90 top
C12  4.83,44.04 270 top
C13  4.57,44.04 90 bottom
C14  4.83,35.05 90 top
C15  24.81,45.74 180 top
C16  24.81,44.68 180 top
C17  24.81,43.65 180 top
C18  13.74,63.88 90 top
C19  24.69,56.92 0 bottom
C20  10.86,68.38 0 top
C21  10.86,66.95 0 top
C22  4.98,19.05 180 top
C23  39.23,27.58 90 top
C24  34.8,28.06 180 top
C25  23.09,70.51 180 bottom
C26  4.83,53.04 90 top
C27  23.09,70.54 0 top
C28  24.69,56.44 180 top
C29  27.25,55.78 90 top
C30  18.26,20.59 180 top
C31  32.89,20.17 180 top
C32  18.26,33.66 0 top
C33  18.26,32.51 0 top
C34  32.89,21.29 180 top
C35  18.69,31.39 0 top
C36  32.89,18.82 180 top
C37  33.58,30.38 270 top
C38  29.57,33.96 270 top
C39  34.9,30.38 270 top
C40  21.34,15.75 90 top
C41  11.2,23.62 0 top
C42  13.64,23.62 0 top
C43  19.71,12.88 270 top
C44  19.74,18.59 90 top
C45  4.57,35.05 270 bottom
C46  10.86,68.86 0 bottom
C47  4.57,53.04 270 bottom
C48  24.31,67.39 90 top
C49  23.16,67.41 90 top
C50  17.3,64.74 90 bottom
C51  17.27,64.77 90 top
C52  52.22,44.5 270 top  (outside the outline)
C53  59.05,47.68 0 top  (outside the outline)
IC1  36.35,4.8 180 top
IC2  3.71,4.83 180 top
IC3  10.79,4.83 180 top
IC4  29.39,4.8 180 top
LED1  2.96,12.73 180 top
R1  32.38,46 0 top
R2  32.38,44.22 0 top
R5  15.82,57.38 180 top
R7  2.04,10.9 180 top
R8  3.05,18.97 270 top
R9  1.78,18.97 270 top
R10  34.79,26.91 0 top
R15  17.27,27.93 225 top
R16  19.7,15.77 270 top
R17  15.85,20.6 180 top
S1  18.69,2.06 180 top
TP5  30.44,55.29 270 top
TP6  33.92,55.22 270 top
TP7  27.61,17.28 270 bottom
TP8  24.33,17.32 270 bottom
TP13  24.87,2.08 0 top
U$1  31.6,63.52 270 top
U$2  16.08,52.93 270 top
U$3  7.92,44.04 90 top
U$4  7.95,35.05 0 top
U$5  28.54,43.73 270 top
U$6  10.86,63.22 270 top
U$7  3.69,23.95 270 top
U$8  37.36,27.57 180 top
U$9  7.95,53.04 0 top
U$10  24.69,52.93 0 top
U$11  25.77,27.36 225 top
U$12  12.42,16.92 90 top
U$13  16.85,15.11 90 top
U$14  12.52,29.35 90 top
U$15  17.19,41.46 0 top
U$16  50.57,31.85 90 top  (outside the outline)
U$17  22.64,63.35 180 top
U$18  33.12,25.48 0 bottom
X3  34.98,13.22 180 top

### Tracks (layer width: path | path; a pad name or v marks a point on that pad's centre or on a via)
1.2V  (2 unrouted)
  Top 0.152: IC4.3 28.4,9.15 | C32.2 C33.2 20.26,32.51 U$11.P$25 | C31.2 32.24,20.75 | 32.24,20.75 C34.2 31.55,21.29 29.79,23.04 29.73,23.04 U$11.P$56 29.64,23.09 29.66,23.09 | 32.22,20.73 32.24,20.75
3.0V  (3 unrouted)
3.3V  (via drill 0.41)  (39 unrouted)
  Top 0.152: C35.2 20.67,31.39 U$11.P$26 | 29.18,22.17 31.27,20.09 31.27,19.18 31.62,18.82 C36.2 | R17.2 15.2,20.74 15.19,20.75 15.19,21.08 15.47,21.36 17.3,21.36 U$11.P$37 | C39.2 C37.2 32.73,29.73 U$11.P$2 | U$4.P$1 5.07,36.05 C14.2 4.33,35.7 v3.58,36.45 | U$3.P$16 | v3.58,54.43 4.33,53.69 C26.2 5.18,54.04 U$9.P$1 | U$3.P$15 U$3.P$16 | v3.58,42.65 4.33,43.39 C12.2 4.98,43.54 U$3.P$16 | C6.2 14.81,49.33 15.6,50.11 15.6,50.89 U$2.P$15 | U$11.P$37 | C40.2 21.34,21.87 U$11.P$42 | R9.2 R8.2 3.23,18.32 3.52,18.34 5.36,18.34 5.63,18.61 C22.1 5.63,21.55 U$7.P$8 | R7.2 1.42,10.87 1.42,10.54 1.4,10.52 IC2.3 | U$11.P$11 29.57,32.92 C38.2 | R1.2 R2.2 | v25.7,57.66 25.34,57.29 C28.1 | U$10.P$14 25.19,56.29 C28.1 | C29.2 C28.1 | v11.94,69.85 11.48,69.4 C20.2 12.24,67.64 12.24,65.23 U$6.P$1 | C2.1 32.11,66.29 32,66.19 U$1.P$2 | C5.1 C3.1 31.6,61.31 U$1.P$8
  Bottom 0.152: C47.P$1 3.58,55.04 v3.58,54.43 | v3.58,36.45 3.58,37.06 C45.P$1 C13.P$1 3.58,42.03 v3.58,42.65 | C19.P$1 26.25,57.66 v25.7,57.66 | C46.P$1 12.87,69.85 v11.94,69.85
5.0V  (4 unrouted)
ANALOG-OUT-ADXL78  (1 unrouted)
ANALOG-OUT-STLM20  (2 unrouted)
CS-ADT7310  (via drill 0.41)
  Top 0.152: U$11.P$43 22.15,21.97 v22.15,21.16 | v9.7,19 9.25,19.46 9.25,24.38 8.56,25.07 2.34,25.07 1.78,25.63 U$7.P$4
  Bottom 0.152: v22.15,21.16 19.99,19 v9.7,19
CS-ADXL362  (1 unrouted)
  Top 0.152: 20.18,38.72 20.18,37.86 20.5,37.54 22.55,37.54 23.14,38.13 23.14,48.11 25.2,50.17 U$10.P$8
CS-ENABLE
  Top 0.152: U$15.P$6 19.09,37.17 19.25,37.01 21.42,37.01 U$11.P$17
CS-FXAS
  Top 0.152: U$15.P$11 19.09,44.28 16.58,46.79 U$2.P$17
CS-LIS3DH
  Top 0.152: 16.51,44.17 U$15.P$13 16.56,44.81 16.15,45.21 11.2,45.21 9.65,46.76 9.65,50.65 8.89,51.41 U$9.P$8
CS-LPS331
  Top 0.152: U$4.P$8 8.76,33.12 11.4,33.12 11.53,33.25 11.53,41.43 11.91,41.81 13.46,41.81 15.28,43.63 U$15.P$14
CS-LSGD
  Top 0.152: U$3.P$5 13.03,42.42 14.1,43.48 14.1,44.05 U$15.P$15
CS-LSM9D30-G  (via drill 0.41)
  Top 0.152: U$15.P$10 20.36,47.64 19.36,48.64 v19.36,57.91 | v19.76,61.32 U$17.P$19
  Bottom 0.152: v19.36,57.91 19.36,60.91 v19.76,61.32
CS-LSM9DS0-XM  (via drill 0.41)
  Top 0.152: U$15.P$9 21.63,47.38 19.94,49.07 v19.94,56.9 | v20.3,60.55 21.57,60.58 21.89,60.91 U$17.P$20
  Bottom 0.152: v19.94,56.9 19.94,60.15 v20.3,60.55
CS-LSM303
  Top 0.152: U$15.P$12 17.82,44.87 16.87,45.82 13.87,45.85 13.84,45.82 12.65,45.82 10.74,47.73 10.74,48.9 10.72,58.34 9.22,60.17 9.22,62.71 U$6.P$8
CT-ADT7310
  Top 0.152: U$7.P$6 R8.1
GND  (via drill 0.41)  (73 unrouted)
  Top 0.152: IC1.2 IC1.4 IC4.4 | IC3.2 IC3.4 | IC4.4 29.64,2.06 TP13.P$1 | IC4.2 29.41,8.13 | IC4.4 IC4.2 | 24.48,1.79 TP13.P$1 | v13.87,1.75 v13.87,1.74 IC3.4 | v23.39,0.97 24.26,0.97 TP13.P$1 | U$3.P$9 U$3.P$10 U$3.P$11 U$3.P$12 U$3.P$13 6.91,45.68 6.91,46.36 6,47.26 C10.2 4.83,46.45 C12.1 4.33,44.69 v3.58,45.44 | IC3.4 IC2.4 IC2.2 LED1.C | U$11.P$55 29.29,22.76 31.6,20.45 31.6,19.51 33.54,19.51 | C34.1 C31.1 33.54,19.51 | 28.68,32.74 U$11.P$12 28.96,33.02 28.96,34.44 29.12,34.61 C38.1 | IC4.2 29.39,12.29 29.1,12.58 20.34,12.53 C43.2 | C36.1 33.54,19.51 | U$11.P$39 21.17,23.84 19.74,22.4 | C39.1 C37.1 33.33,31.03 U$11.P$3 | U$4.P$5 5.07,34.05 C14.1 4.33,34.4 v3.58,33.66 | v3.58,51.64 4.33,52.39 C26.1 5.18,52.04 U$9.P$5 | C6.1 C7.2 | 28.73,32.79 28.75,32.79 | C30.1 18.91,21.58 19.74,22.4 | C44.2 19.74,22.4 | U$7.P$7 C22.2 | U$5.P$3 24.38,43.1 24.16,43.33 C17.2 C16.2 C15.2 | v23.67,57.66 24.04,57.29 C28.2 24.19,56.29 U$10.P$16 | U$10.P$13 27.01,53.93 27.25,54.18 C29.1 | v9.75,69.85 10.18,69.42 C20.1 9.47,67.64 9.47,65.23 U$6.P$5 | U$1.P$5 30.3,65.16 30.3,67.97 30.5,68.17 C4.2 C2.2 C1.2 | C5.2 C3.2 32.4,61.17 U$1.P$10
  Bottom 0.152: v13.87,1.75 14.46,1.75 14.46,0.92 v23.39,0.97 | v3.58,51.64 3.58,51.03 C47.P$2 C13.P$2 3.58,46.05 v3.58,45.44 | C45.P$2 3.58,33.04 v3.58,33.66 | C19.P$2 23.12,57.66 v23.67,57.66 | C46.P$2 8.85,69.85 v9.75,69.85
INT1-ADXL362  (via drill 0.41)
  Top 0.152: U$11.P$8 30.61,31.84 30.61,35.2 25.96,39.85 v25.96,41 | v27.28,52.93 U$10.P$11
  Bottom 0.152: v25.96,41 25.96,51.61 v27.28,52.93
INT1-FXAS  (via drill 0.41)
  Top 0.152: U$2.P$3 16.58,53.02 v16.64,52.96 | U$11.P$9 30.28,32.22 30.28,35 29.87,35.41 29.54,35.41 v24.64,40.31
  Bottom 0.152: v16.64,52.96 19.18,52.98 19.86,52.3 19.84,45.11 v24.64,40.31
INT1-L3GD  (via drill 0.41)
  Top 0.152: v10.46,44.04 U$3.P$7 | v23.8,38.51 27.89,34.42 27.89,34.09 U$11.P$15
  Bottom 0.152: 18.24,44.07 17.58,44.07 | 17.58,44.07 v10.46,44.04 | v23.8,38.51 18.24,44.07 17.58,44.07
INT1-LIS3DH  (via drill 0.41)
  Top 0.152: v10.39,47.07 10.39,53.01 9.6,53.01 U$9.P$11 | v24.71,38.46 28.25,34.93 28.25,33.73 27.87,33.36 U$11.P$14
  Bottom 0.152: 17.78,45.42 17.58,45.42 | 17.58,45.42 11.71,45.44 10.39,46.76 v10.39,47.07 | v24.71,38.46 17.75,45.42 17.58,45.42
INT1-LSM303  (via drill 0.41)
  Top 0.152: 28.22,33.02 U$11.P$13 28.65,33.43 28.65,35.38 v24.66,39.37 | v12.42,47.07 11.11,48.37 11.11,48.96 11.1,58.67 10.85,58.93 10.85,61.44 10.86,61.46 U$6.P$11
  Bottom 0.152: v12.42,47.07 13.16,46.33 17.7,46.33 v24.66,39.37
INT1-MAG3110  (via drill 0.41)
  Top 0.152: U$11.P$5 31.52,30.64 31.52,35.71 27.71,39.52 v27.71,40.34 | v30.12,63.2 31.83,63.2 32,63.02 U$1.P$9
  Bottom 0.152: v27.71,40.34 27.71,51.61 28.68,52.58 28.68,55.17 28.98,55.47 28.98,62.05 v30.12,63.2
INT1-MPL311  (via drill 0.41)
  Top 0.152: v31.14,43.1 31.26,43.1 U$5.P$6 | v28.3,41 28.3,39.4 31.85,35.84 31.85,30.23 U$11.P$4
  Bottom 0.152: v31.14,43.1 31.26,43.1 30.38,43.1 30.02,42.74 v28.3,41
INT2-LPS331  (via drill 0.41)
  Top 0.152: U$11.P$16 27.17,34.06 26.16,33.05 v24.92,33.05 | v10.82,34.09 10.79,34.05 U$4.P$9
  Bottom 0.152: v24.92,33.05 23.27,31.39 19.25,31.39 16.56,34.09 v10.82,34.09
INT-ADT7310
  Top 0.152: U$7.P$5 R9.1
LSM9D-INT1-XM  (via drill 0.41)
  Top 0.152: U$11.P$7 30.35,30.9 30.91,31.46 30.91,35.38 26.54,39.75 v26.54,40.34 | U$17.P$13 | U$17.P$13 | U$17.P$13 v19.63,64.59
  Bottom 0.152: v19.63,64.59 26.77,64.59 28.27,63.09 28.32,55.83 27.99,55.5 28.02,52.81 26.54,51.33 v26.54,40.34
LSM9D-INT-G  (via drill 0.41)
  Top 0.152: U$11.P$6 30.7,30.54 31.22,31.06 31.22,35.56 27.13,39.65 v27.13,41 | v21.97,66.62 21.97,65.4 U$17.P$11
  Bottom 0.152: v21.97,66.62 22.2,66.85 24.99,66.85 28.63,63.22 28.63,55.6 28.35,55.32 28.35,52.68 27.13,51.46 v27.13,41
MISO-A
  Top 0.152: U$11.P$28 19.97,30.68 16.89,30.68 16.59,30.98 U$14.P$8
MISO-B  (via drill 0.41)
  Top 0.152: U$17.P$23 U$17.P$22 22.89,60.78 22.89,60.12 22.02,59.26 v11.69,59.26 v11.69,53.87 11.69,53.77 11.71,53.75 11.71,52.88 13.66,50.93 14.56,50.93 U$2.P$13 | v10.64,62.64 10.06,63.22 U$6.P$7 | U$4.P$7 7.95,33.19 8.01,33.12 | 8.01,33.12 8.01,33.48 | U$3.P$4 8.43,41.49 8.43,41.48 8.56,41.38 v8.89,41.05 | 8.01,33.12 7.92,33.12 7.9,33.1 7.9,32.44 v8.45,31.89 8.45,31.58 9.04,30.99 9.04,30.98 U$14.P$13 | U$7.P$2 4.32,27.16 v5.26,28.09 | U$9.P$7 7.95,51.13 7.98,51.1 7.98,50.57 8.33,50.22 v8.87,50.22 | v21.21,51.84 22.78,50.27 24.38,50.27 24.69,50.57 U$10.P$7
  Bottom 0.152: v10.64,62.64 11.69,61.59 v11.69,59.26 | v5.26,28.09 7.64,28.09 8.87,29.31 8.87,31.47 v8.45,31.89 8.45,32.42 8.89,32.87 v8.89,41.05 8.89,49.82 v8.87,50.22 8.87,52.45 10.31,53.9 v11.69,53.87 19.23,53.87 21.21,51.89 v21.21,51.84
MOSI-A
  Top 0.152: U$11.P$29 19.56,30.38 16.87,30.38 16.82,30.33 U$14.P$7
MOSI-B  (via drill 0.41)
  Top 0.152: U$9.P$6 7.44,51.31 7.44,50.34 v8.26,49.53 | 24.23,50.97 U$10.P$6 24.16,51.44 22.53,51.44 21.61,52.35 v21.61,52.73 | v10.67,63.65 10.6,63.72 U$6.P$6 | U$17.P$24 23.89,59.72 22.79,58.62 v12.29,58.62 v12.29,54.51 12.29,52.89 13.28,51.89 14.01,51.89 U$2.P$12 | U$3.P$3 7.92,41.41 8.27,41.07 8.27,39.94 v8.26,39.9 | U$4.P$6 7.45,31.46 v7.95,30.96 7.95,30.68 8.28,30.35 8.28,30.33 U$14.P$14 | U$7.P$3 3.05,27.08 v4.9,28.93
  Bottom 0.152: v12.29,58.62 12.29,61.98 v10.67,63.65 | v4.9,28.93 7.62,28.93 8.13,29.44 8.13,30.78 v7.95,30.96 7.77,31.14 7.77,32.26 8.26,32.74 v8.26,39.9 v8.26,49.53 8.26,52.83 9.96,54.53 v12.29,54.51 19.3,54.48 19.91,54.48 21.61,52.78 v21.61,52.73
N$1
  Top 0.152: C1.1 33.22,66.22 32.41,65.41 32.41,64.68 U$1.P$1
N$2
  Top 0.152: C7.1 15.85,49.91 16.08,50.14 U$2.P$16
N$3
  Top 0.152: U$1.P$4 31.2,66.16 31.01,66.34 C4.1
N$4
  Top 0.152: C10.1 5.64,45.2 U$3.P$14
N$5
  Top 0.152: C17.1 25.84,43.65 26.54,44.35 U$5.P$2
N$6  (1 unrouted)
N$7
  Top 0.152: C21.2 11.51,66.52 11.35,66.37 U$6.P$2
N$8  (1 unrouted)
N$9  (1 unrouted)
N$10
  Top 0.152: R17.1 C30.2 17.61,20.97 U$11.P$38
N$11
  Top 0.152: U$12.P$2 13.67,22.23 14.25,22.81 14.25,23.58 C42.2 14.93,24.26 19.48,24.26 U$11.P$36
N$12
  Top 0.152: U$11.P$34 18.81,24.99 11,24.99 10.55,24.55 C41.1 10.54,23.61 10.54,22.89 11.17,22.26 U$12.P$1
N$13
  Top 0.152: C41.2 12.42,23.62 | 12.42,23.62 C42.1 | U$11.P$35 19.13,24.61 14.33,24.61 13.61,23.9 12.42,23.62
N$14
  Top 0.152: U$13.P$1 17.63,14 19.24,14 C43.1 19.71,15.11 R16.2
N$15
  Top 0.152: C21.1 10.21,66.55 10.39,66.37 10.77,66.37 10.95,66.19 10.95,64.93 U$6.P$3
N$16
  Top 0.152: 21.54,23.47 U$11.P$40 20.68,22.62 20.68,18.44 20.18,17.94 C44.1 18.9,17.11 U$13.P$2
N$17
  Top 0.152: 21.89,23.13 U$11.P$41 20.98,22.22 20.98,17.88 19.7,16.6 R16.1
N$18
  Top 0.152: U$11.P$32 18.76,29.06 18.39,29.06 R15.1
N$19  (1 unrouted)
N$21  (1 unrouted)
N$22  (1 unrouted)
N$23  (via drill 0.33 pad 0.15)
  Top 0.152: 16.31,3.82 S1.3 16.41,3.81 16.41,5 v14.63,4.95 | 39.19,4.98 v38.71,4.83 IC1.1 | IC2.1 v6.02,4.93 | IC3.1 v13.11,4.95 | IC4.1 v31.75,4.98
  Bottom 0.152: v6.02,4.93 v13.11,4.95 v14.63,4.95 17.09,5 v31.75,4.98 v38.71,4.83
N$25
  Top 0.152: C16.1 C15.1 26.14,45.74 26.29,45.59 27.2,45.59 U$5.P$1
N$27
  Top 0.152: LED1.A 2.18,12.7 2.18,12.57 2.16,12.55 2.16,12.07 2.69,11.53 R7.1
RST_B  (1 unrouted)
SCL-0  (via drill 0.41)  (3 unrouted)
  Top 0.152: 31.68,45.84 31.68,45.74 v32.33,45.09 | U$5.P$8 29.87,45.59 30.89,45.59 31.29,46 R1.1 | U$11.P$23 21.67,32.52 21.67,32.77 v22.07,33.17
  Bottom 0.152: v32.33,45.09 32.33,39.78 31.14,38.58 27.46,38.58 22.07,33.2 v22.07,33.17
SCLK-A
  Top 0.152: U$11.P$30 19.19,30.05 16.99,30.05 16.62,29.68 U$14.P$6
SCLK-B  (via drill 0.41)
  Top 0.152: 6.34,52.45 U$9.P$4 v7.62,52.53 | 10.34,64.87 U$6.P$4 v10.36,65.79 | v12.92,59.89 22.12,59.89 22.35,60.12 22.35,60.75 U$17.P$21 22.38,60.77 | U$3.P$2 7.42,40.94 v7.62,40.77 | 7.84,29.68 v7.47,30.05 7.04,30.48 7.04,34.34 6.83,34.55 U$4.P$4 | U$7.P$1 5.59,27.43 7.84,29.68 | U$14.P$15 7.84,29.68 | v12.9,55.12 12.9,52.76 13.21,52.45 14.04,52.45 U$2.P$11 | v22.01,53.64 22.23,53.42 22.23,52.45 22.23,52.46 U$10.P$4
  Bottom 0.152: v12.9,55.12 8.94,55.14 7.62,53.82 v7.62,52.53 v7.62,40.77 7.62,32.64 7.16,32.18 7.16,30.35 v7.47,30.05 | v12.9,55.12 19.3,55.09 20.6,55.09 22.01,53.69 v22.01,53.64 | v12.9,55.12 v12.92,59.89 12.92,62.29 U$6.P$4 10.36,65.43 v10.36,65.79
SD-CARD-INSERT  (via drill 0.41)
  Top 0.152: U$11.P$60 32.44,23.16 v36.2,23.16
  Bottom 0.152: U$18.P$8 36.63,22.73 v36.2,23.16
SD-CS  (via drill 0.41)
  Top 0.152: U$11.P$62 32.64,24.37 v32.79,24.36
  Bottom 0.152: U$18.P$2 30.37,21.1 32.79,23.52 v32.79,24.36
SD-MISO  (via drill 0.41)
  Top 0.152: U$11.P$63 32.77,24.95 v35.31,24.95
  Bottom 0.152: v35.31,24.95 35.31,22.76 35.87,22.2 U$18.P$7
SD-MOSI  (via drill 0.41)
  Top 0.152: U$11.P$64 32.87,25.56 v33.4,25.56
  Bottom 0.152: U$18.P$3 31.47,21.67 33.4,23.6 v33.4,25.56
SD-SCLK  (via drill 0.41)
  Top 0.152: U$11.P$61 32.54,23.77 v34.11,23.77
  Bottom 0.152: U$18.P$5 33.67,22.19 34.09,22.61 34.09,23.74 v34.11,23.77
SDA-0  (via drill 0.41)  (2 unrouted)
  Top 0.152: U$5.P$7 30.55,44.22 R2.1 v31.73,42.24 | U$11.P$24 21.16,32.32 v21.16,33.1
  Bottom 0.152: v31.73,42.24 31.73,39.84 30.84,38.94 27,38.94 v21.16,33.1
SPI-ADDR0
  Top 0.152: 12.68,38.53 12.74,38.6 U$15.P$1 12.7,38.74 12.7,36.27 13.41,35.56 20.75,35.56 U$11.P$20
SPI-ADDR1
  Top 0.152: U$15.P$2 14.01,36.46 14.33,36.14 20.87,36.14 U$11.P$19
SPI-ADDR2
  Top 0.152: U$15.P$3 15.28,36.92 15.65,36.55 21.17,36.55 U$11.P$18
SPI-ENABLE  (via drill 0.41)
  Top 0.152: v17.27,29.46 19.04,29.46 U$11.P$31 | v16.59,31.81 16.12,32.28 U$14.P$10
  Bottom 0.152: v16.59,31.81 16.59,30.15 v17.27,29.46
SWCLK
  Top 0.152: U$11.P$52 28.45,21.49 28.45,21.44 31.14,18.75 31.14,15.88 31.55,15.47 X3.4
SWDIO
  Top 0.152: U$11.P$51 30.79,18.45 30.79,14.45 31.27,13.97 X3.3
SWO
  Top 0.152: U$11.P$49 30.12,17.7 30.12,11.56 30.71,10.97 X3.1
TDI
  Top 0.152: U$11.P$50 30.45,18.07 30.45,12.98 30.96,12.47 X3.2
U1RX  (1 unrouted)
U1TX  (1 unrouted)
(copper drawn outside any net)
  shapes: Top area x1